# Altium schematic sheet [05] - I2C.SchDoc
size A3; DocumentNumber: 9; SheetNumber: 9; SheetTotal: 14
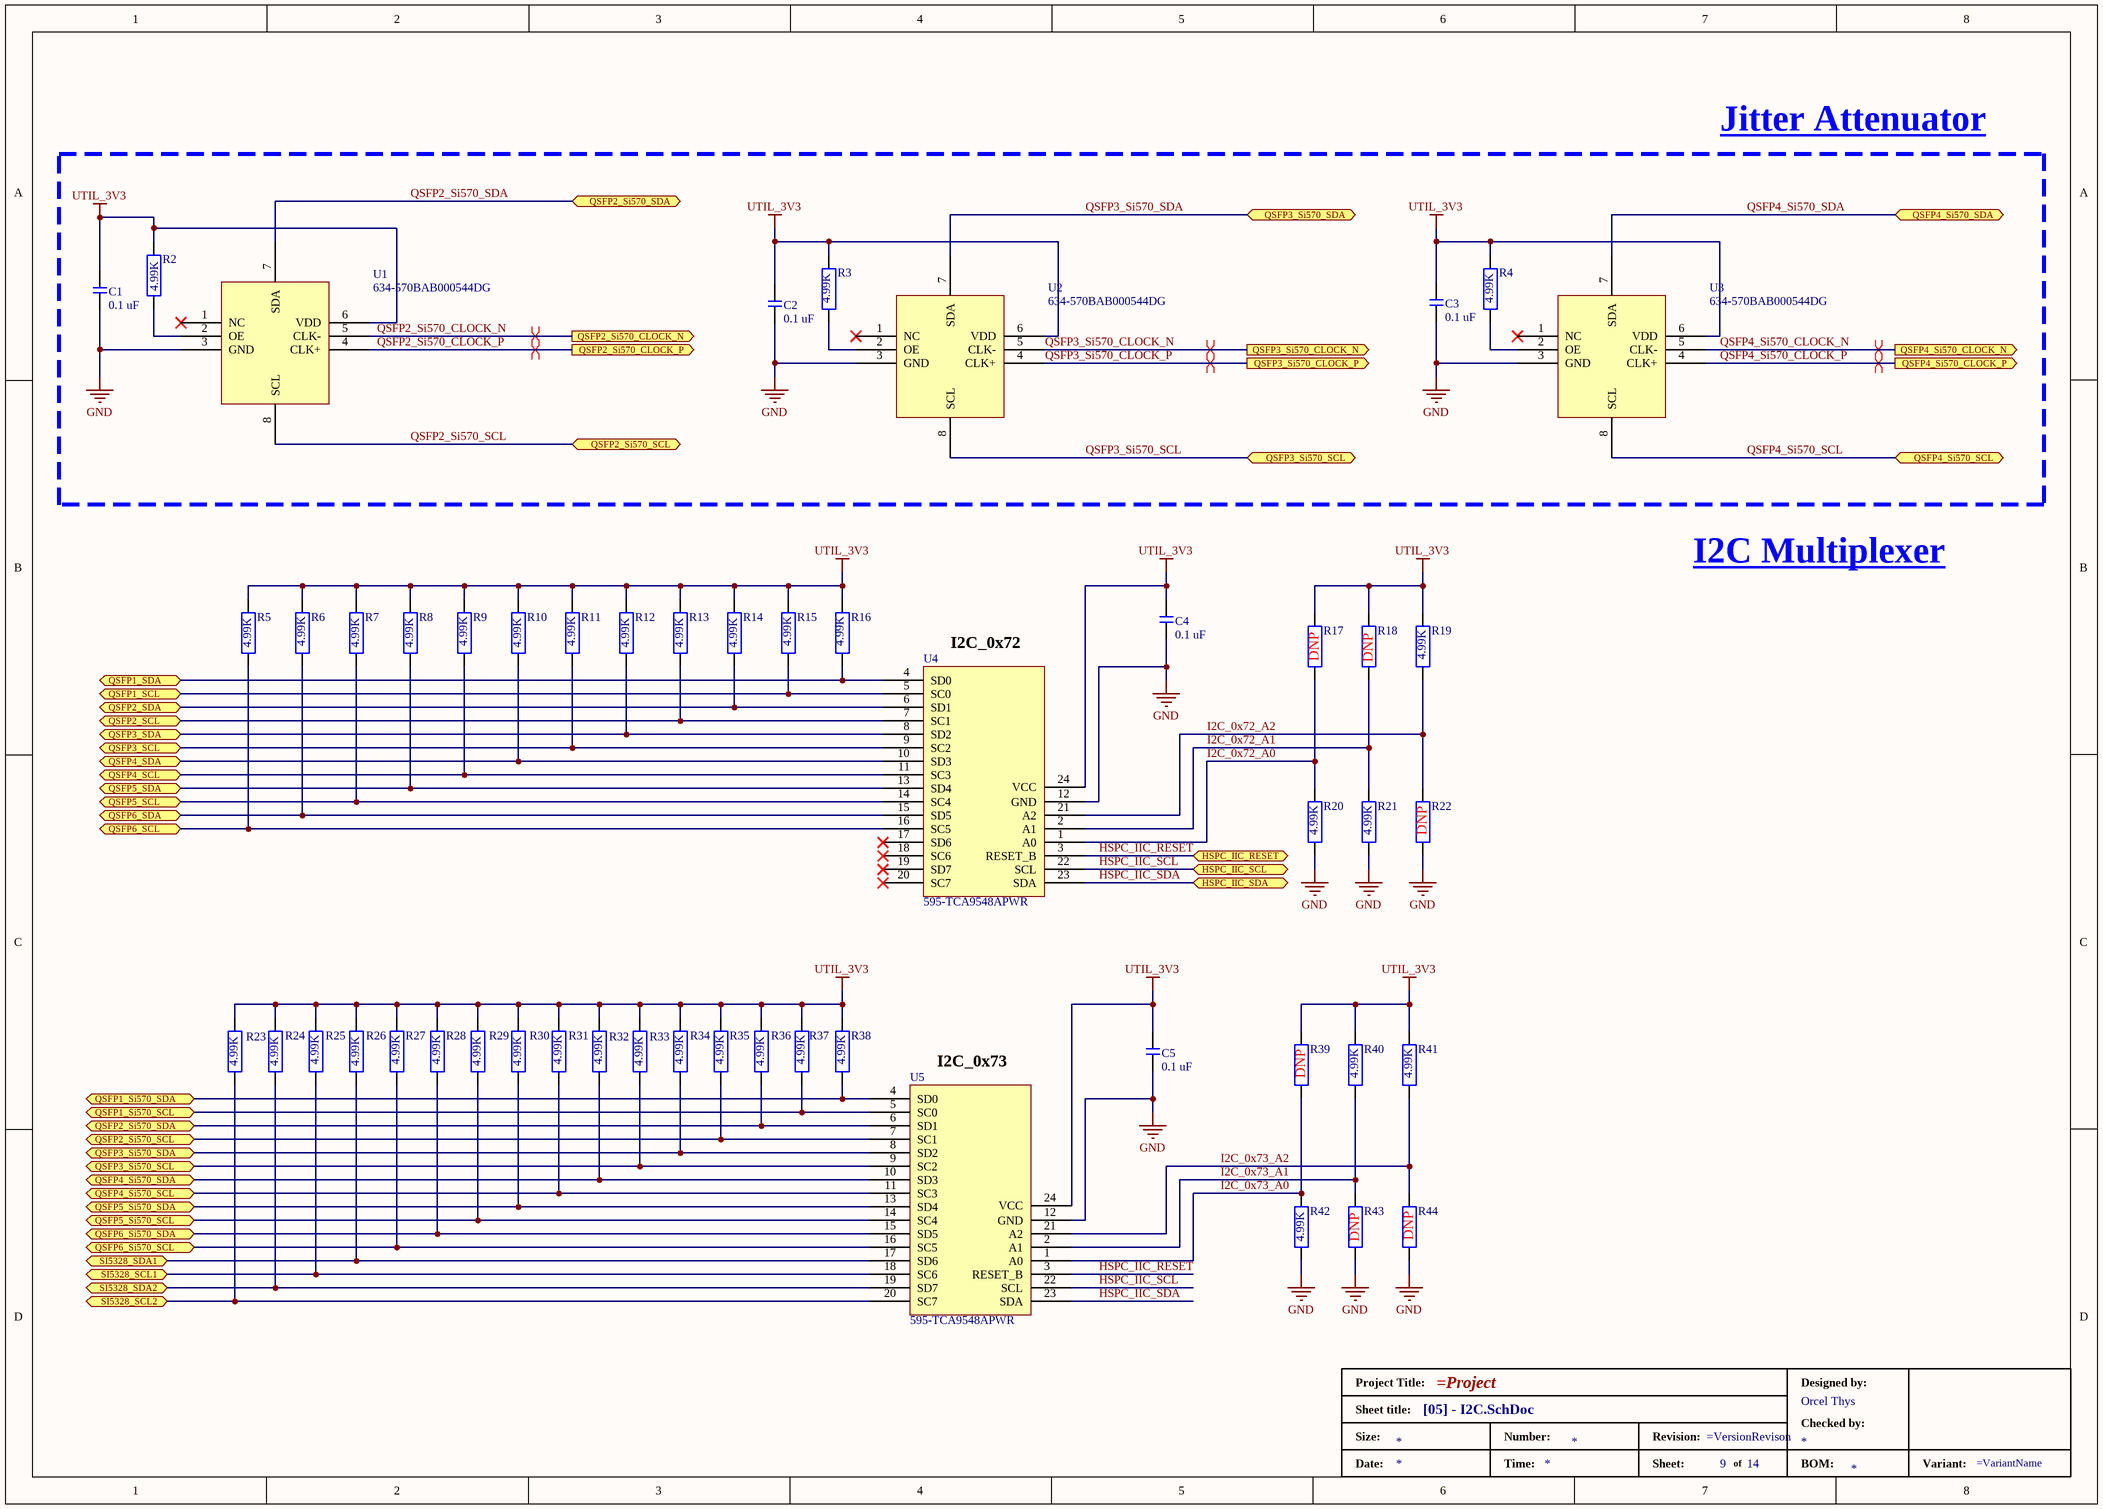
[diagram p0: [05] - I2C.SchDoc]

## Parts
*  DesignedBy: Orcel Thys  (hidden comment: Standard Title Block)  (graphical)
C1  0.1 uF  [C0402]
C2  0.1 uF  [C0402]
C3  0.1 uF  [C0402]
C4  0.1 uF  [C0402]
C5  0.1 uF  [C0402]
R2  4.99K  [R0402]
R3  4.99K  [R0402]
R4  4.99K  [R0402]
R5  4.99K  [R0402]
R6  4.99K  [R0402]
R7  4.99K  [R0402]
R8  4.99K  [R0402]
R9  4.99K  [R0402]
R10  4.99K  [R0402]
R11  4.99K  [R0402]
R12  4.99K  [R0402]
R13  4.99K  [R0402]
R14  4.99K  [R0402]
R15  4.99K  [R0402]
R16  4.99K  [R0402]
R17  4.99K  [R0402]  (value not drawn)
R18  4.99K  [R0402]  (value not drawn)
R19  4.99K  [R0402]
R20  4.99K  [R0402]
R21  4.99K  [R0402]
R22  4.99K  [R0402]  (value not drawn)
R23  4.99K  [R0402]
R24  4.99K  [R0402]
R25  4.99K  [R0402]
R26  4.99K  [R0402]
R27  4.99K  [R0402]
R28  4.99K  [R0402]
R29  4.99K  [R0402]
R30  4.99K  [R0402]
R31  4.99K  [R0402]
R32  4.99K  [R0402]
R33  4.99K  [R0402]
R34  4.99K  [R0402]
R35  4.99K  [R0402]
R36  4.99K  [R0402]
R37  4.99K  [R0402]
R38  4.99K  [R0402]
R39  4.99K  [R0402]  (value not drawn)
R40  4.99K  [R0402]
R41  4.99K  [R0402]
R42  4.99K  [R0402]
R43  4.99K  [R0402]  (value not drawn)
R44  4.99K  [R0402]  (value not drawn)
U1  Supplier Part Number 1: 634-570BAB000544DG  [Si570]  (hidden comment: Si570)
U2  Supplier Part Number 1: 634-570BAB000544DG  [Si570]  (hidden comment: Si570)
U3  Supplier Part Number 1: 634-570BAB000544DG  [Si570]  (hidden comment: Si570)
U4  Supplier Part Number 1: 595-TCA9548APWR  [SOP_65P640X120-24N]  (hidden comment: 8-Channels I2C switch)
U5  Supplier Part Number 1: 595-TCA9548APWR  [SOP_65P640X120-24N]  (hidden comment: 8-Channels I2C switch)

## Blocks framed on the sheet
Jitter Attenuator: C1-C3 R2-R4 U1-U3

## Ports
HSPC_IIC_RESET (bidir), HSPC_IIC_SCL (bidir), HSPC_IIC_SDA (bidir), QSFP1_SCL (bidir), QSFP1_SDA (bidir), QSFP1_Si570_SCL (bidir), QSFP1_Si570_SDA (bidir), QSFP2_SCL (bidir), QSFP2_SDA (bidir), QSFP2_Si570_CLOCK_N (out), QSFP2_Si570_CLOCK_P (out), QSFP2_Si570_SCL (bidir), QSFP2_Si570_SDA (bidir), QSFP3_SCL (bidir), QSFP3_SDA (bidir), QSFP3_Si570_CLOCK_N (out), QSFP3_Si570_CLOCK_P (out), QSFP3_Si570_SCL (bidir), QSFP3_Si570_SDA (bidir), QSFP4_SCL (bidir), QSFP4_SDA (bidir), QSFP4_Si570_CLOCK_N (out), QSFP4_Si570_CLOCK_P (out), QSFP4_Si570_SCL (bidir), QSFP4_Si570_SDA (bidir), QSFP5_SCL (bidir), QSFP5_SDA (bidir), QSFP5_Si570_SCL (bidir), QSFP5_Si570_SDA (bidir), QSFP6_SCL (bidir), QSFP6_SDA (bidir), QSFP6_Si570_SCL (bidir), QSFP6_Si570_SDA (bidir), SI5328_SCL1 (bidir), SI5328_SCL2 (bidir), SI5328_SDA1 (bidir), SI5328_SDA2 (bidir)

## Nets
GND: C1.2 C2.2 C3.2 C4.1 C5.1 R20.1 R21.1 R22.1 R42.1 R43.1 R44.1 U1.3(GND) U2.3(GND) U3.3(GND) U4.12(GND) U5.12(GND)
UTIL_3V3: C1.1 C2.1 C3.1 C4.2 C5.2 R2.2 R3.2 R4.2 R5.2 R6.2 R7.2 R8.2 R9.2 R10.2 R11.2 R12.2 R13.2 R14.2 R15.2 R16.2 R17.2 R18.2 R19.2 R23.2 R24.2 R25.2 R26.2 R27.2 R28.2 R29.2 R30.2 R31.2 R32.2 R33.2 R34.2 R35.2 R36.2 R37.2 R38.2 R39.2 R40.2 R41.2 U1.6(VDD) U2.6(VDD) U3.6(VDD) U4.24(VCC) U5.24(VCC)
HSPC_IIC_RESET: U4.3(RESET_B) U5.3(RESET_B) ; port HSPC_IIC_RESET
HSPC_IIC_SCL: U4.22(SCL) U5.22(SCL) ; port HSPC_IIC_SCL
HSPC_IIC_SDA: U4.23(SDA) U5.23(SDA) ; port HSPC_IIC_SDA
I2C_0x72_A0: R17.1 R20.2 U4.1(A0)
I2C_0x72_A1: R18.1 R21.2 U4.2(A1)
I2C_0x72_A2: R19.1 R22.2 U4.21(A2)
I2C_0x73_A0: R39.1 R42.2 U5.1(A0)
I2C_0x73_A1: R40.1 R43.2 U5.2(A1)
I2C_0x73_A2: R41.1 R44.2 U5.21(A2)
QSFP1_SCL: R15.1 U4.5(SC0) ; port QSFP1_SCL
QSFP1_SDA: R16.1 U4.4(SD0) ; port QSFP1_SDA
QSFP1_Si570_SCL: R37.1 U5.5(SC0) ; port QSFP1_Si570_SCL
QSFP1_Si570_SDA: R38.1 U5.4(SD0) ; port QSFP1_Si570_SDA
QSFP2_SCL: R13.1 U4.7(SC1) ; port QSFP2_SCL
QSFP2_SDA: R14.1 U4.6(SD1) ; port QSFP2_SDA
QSFP2_Si570_CLOCK_N: U1.5(CLK-) ; port QSFP2_Si570_CLOCK_N
QSFP2_Si570_CLOCK_P: U1.4(CLK+) ; port QSFP2_Si570_CLOCK_P
QSFP2_Si570_SCL: R35.1 U1.8(SCL) U5.7(SC1) ; port QSFP2_Si570_SCL
QSFP2_Si570_SDA: R36.1 U1.7(SDA) U5.6(SD1) ; port QSFP2_Si570_SDA
QSFP3_SCL: R11.1 U4.9(SC2) ; port QSFP3_SCL
QSFP3_SDA: R12.1 U4.8(SD2) ; port QSFP3_SDA
QSFP3_Si570_CLOCK_N: U2.5(CLK-) ; port QSFP3_Si570_CLOCK_N
QSFP3_Si570_CLOCK_P: U2.4(CLK+) ; port QSFP3_Si570_CLOCK_P
QSFP3_Si570_SCL: R33.1 U2.8(SCL) U5.9(SC2) ; port QSFP3_Si570_SCL
QSFP3_Si570_SDA: R34.1 U2.7(SDA) U5.8(SD2) ; port QSFP3_Si570_SDA
QSFP4_SCL: R9.1 U4.11(SC3) ; port QSFP4_SCL
QSFP4_SDA: R10.1 U4.10(SD3) ; port QSFP4_SDA
QSFP4_Si570_CLOCK_N: U3.5(CLK-) ; port QSFP4_Si570_CLOCK_N
QSFP4_Si570_CLOCK_P: U3.4(CLK+) ; port QSFP4_Si570_CLOCK_P
QSFP4_Si570_SCL: R31.1 U3.8(SCL) U5.11(SC3) ; port QSFP4_Si570_SCL
QSFP4_Si570_SDA: R32.1 U3.7(SDA) U5.10(SD3) ; port QSFP4_Si570_SDA
QSFP5_SCL: R7.1 U4.14(SC4) ; port QSFP5_SCL
QSFP5_SDA: R8.1 U4.13(SD4) ; port QSFP5_SDA
QSFP5_Si570_SCL: R29.1 U5.14(SC4) ; port QSFP5_Si570_SCL
QSFP5_Si570_SDA: R30.1 U5.13(SD4) ; port QSFP5_Si570_SDA
QSFP6_SCL: R5.1 U4.16(SC5) ; port QSFP6_SCL
QSFP6_SDA: R6.1 U4.15(SD5) ; port QSFP6_SDA
QSFP6_Si570_SCL: R27.1 U5.16(SC5) ; port QSFP6_Si570_SCL
QSFP6_Si570_SDA: R28.1 U5.15(SD5) ; port QSFP6_Si570_SDA
SI5328_SCL1: R25.1 U5.18(SC6) ; port SI5328_SCL1
SI5328_SCL2: R23.1 U5.20(SC7) ; port SI5328_SCL2
SI5328_SDA1: R26.1 U5.17(SD6) ; port SI5328_SDA1
SI5328_SDA2: R24.1 U5.19(SD7) ; port SI5328_SDA2
NetR2_1: R2.1 U1.2(OE)
NetR3_1: R3.1 U2.2(OE)
NetR4_1: R4.1 U3.2(OE)

Not connected (* = marked no-connect by the designer): U1 1(NC)*; U2 1(NC)*; U3 1(NC)*; U4 17(SD6)* 18(SC6)* 19(SD7)* 20(SC7)*

## Layout directives
differential pair: QSFP2_Si570_CLOCK_N, QSFP2_Si570_CLOCK_P, QSFP3_Si570_CLOCK_N, QSFP3_Si570_CLOCK_P, QSFP4_Si570_CLOCK_N, QSFP4_Si570_CLOCK_P

## Notes on the sheet
- I2C Multiplexer
- (near U4) I2C_0x72
- (near R17) DNP
- (near R18) DNP
- (near R22) DNP
- (near U5) I2C_0x73
- (near R39) DNP
- (near R43) DNP
- (near R44) DNP
- Title
- Size:
- Date:
- A4
- Number:
- Time:
- Revision:
- Sheet
- of
- File:
- (in symbol Title_Block) Project Title:; Designed by:; Sheet title:; Checked by:; Size:; Number:; Revision:; Date:; Time:; Sheet:; of; BOM:; Variant:

## Library data of the parts
* = Title_Block: Size: *; BOM: *; DW: *; CheckedBy: *
C1-C5 = UMK105B7104KV-FR: Cap 0402 0.1 uF 50 V ±10 % Tolerance X7R Surface Mount Multilayer Ceramic Capacitor; Manufacturer: Taiyo Yuden; Voltage Rating: 50V; Capacitance: 100nF; Tolerance: 10%; Supplier 1: Rs; Manufacturer Part Number: UMK105B7104KV-FR; RoHS: Yes; Category: Ceramic Capacitors; Stock 1: 60000; Pricing 1: 10000=0.016 (EUR); Mount: Surface Mount; Case/Package: 0402; Case Code (Imperial): 0402; Case Code (Metric): 1005; Min Operating Temperature: -55°C; Max Operating Temperature: 125°C; Voltage Rating (DC): 50V; Packaging: Tape and Reel; Package Quantity: 1; Dielectric: X7R; Termination: SMD/SMT; Series: M; Length: 0.039inch; Width: 0.02inch; Height: 0.5mm; Thickness: 0.022inch; Lead Free: Lead Free; Halogen Free: Halogen Free; RoHS Compliant: Yes; ComponentLink1URL: https://datasheet.ciiva.com/24356/619umk105b7104kv-fr-24356845.pdf?src-supplier=Onlinecomponents.com; ComponentLink1Description: https://datasheet.ciiva.com/24356/619umk105b7104kv-fr-24356845.pdf?src-supplier=Onlinecomponents.com; ComponentLink2URL: https://datasheet.ciiva.com/30180/52umk105b7104kv-fr-30180098.pdf?src-supplier=Onlinecomponents.com; ComponentLink2Description: https://datasheet.ciiva.com/30180/52umk105b7104kv-fr-30180098.pdf?src-supplier=Onlinecomponents.com; ComponentLink3URL: https://datasheet.ciiva.com/18697/mlcc-all-e-18697452.pdf?src-supplier=Digi-Key; ComponentLink3Description: https://datasheet.ciiva.com/18697/mlcc-all-e-18697452.pdf?src-supplier=Digi-Key; ComponentLink4URL: https://datasheet.ciiva.com/18697/mlcc-all-e-18697451.pdf?src-supplier=Digi-Key; ComponentLink4Description: https://datasheet.ciiva.com/18697/mlcc-all-e-18697451.pdf?src-supplier=Digi-Key; ComponentLink5URL: https://datasheet.ciiva.com/18697/mlcc-all-e-18697453.pdf?src-supplier=Digi-Key; ComponentLink5Description: https://datasheet.ciiva.com/18697/mlcc-all-e-18697453.pdf?src-supplier=Digi-Key; Supplier Part Number 1: 1782869
R2-R44 = ERJ-2RKF4991X: RES SMD 4.99K OHM 1% 1/10W 0402; Manufacturer: Panasonic; Resistance: 4.99kR; Power Rating: 100mW; Voltage Rating: 50V; Temperature Coefficient: 100ppm/°C; Supplier 1: Mouser; Manufacturer Part Number: ERJ-2RKF4991X; RoHS: Yes; Category: Chip SMD Resistors; Stock 1: 1218727; Pricing 1: 1=0.1, 10=0.018, 50=0.018, 100=0.008, 1000=0.006, 10000=0.004 (USD); Mount: Surface Mount; Case/Package: 0402; Case Code (Metric): 1005; Case Code (Imperial): 0402; Contact Plating: Tin; Weight: 2.8E-05oz; Min Operating Temperature: -55°C; Max Operating Temperature: 155°C; Tolerance: 1%; Packaging: Tape and Reel; Package Quantity: 1; Resistor Type: Thick Film; Number of Terminations: 2; Termination: SMD/SMT; Max Power Dissipation: 100mW; Voltage Rating (DC): 50V; Features: Automotive AEC-Q200; Series: ERJ; Resistance Tolerance: 1%; Construction: Rectangular; Working Voltage: 50V; Technology: THICK FILM; Length: 1mm; Width: 0.5mm; Height: 0.016inch; Depth: 0.5mm; Radiation Hardening: No; Reach SVHC Compliant: No; Military Standard: Not; Lead Free: Lead Free; RoHS Compliant: Yes; ComponentLink1URL: https://datasheet.ciiva.com/46388/426256-46388311.pdf?src-supplier=Element14; ComponentLink1Description: https://datasheet.ciiva.com/46388/426256-46388311.pdf?src-supplier=Element14; ComponentLink2URL: https://datasheet.ciiva.com/46376/426256-46376955.pdf?src-supplier=Element14; ComponentLink2Description: https://datasheet.ciiva.com/46376/426256-46376955.pdf?src-supplier=Element14; ComponentLink3URL: https://datasheet.ciiva.com/22749/1678782-22749654.pdf?src-supplier=Element14; ComponentLink3Description: https://datasheet.ciiva.com/22749/1678782-22749654.pdf?src-supplier=Element14; ComponentLink4URL: https://datasheet.ciiva.com/24158/aoa0000ce2-24158871.pdf?src-supplier=Mouser; ComponentLink4Description: https://datasheet.ciiva.com/24158/aoa0000ce2-24158871.pdf?src-supplier=Mouser; ComponentLink5URL: https://datasheet.ciiva.com/16775/70260748-16775018.pdf?src-supplier=Allied+Electronics; ComponentLink5Description: https://datasheet.ciiva.com/16775/70260748-16775018.pdf?src-supplier=Allied+Electronics; ComponentLink6URL: https://datasheet.ciiva.com/16773/70260748-16773110.pdf?src-supplier=Allied+Electronics; ComponentLink6Description: https://datasheet.ciiva.com/16773/70260748-16773110.pdf?src-supplier=Allied+Electronics; ComponentLink7URL: https://datasheet.ciiva.com/16199/aoa0000ce2-16199546.pdf?src-supplier=Future+Electronics; ComponentLink7Description: https://datasheet.ciiva.com/16199/aoa0000ce2-16199546.pdf?src-supplier=Future+Electronics; Supplier Part Number 1: 667-ERJ-2RKF4991X
U1-U3 = 570BAB000544DG: 10 MHZ TO 810 MHZ I2C PROG 0x5D, 156.25MHz DEFAULT; Manufacturer: Skyworks Solutions; Supplier 1: Mouser; Manufacturer Part Number: 570BAB000544DG; RoHS: No; Category: Oscillators; Stock 1: 1408; Pricing 1: 1=42.62, 10=40.41, 50=39.67, 100=38.2, 1000=38.2, 10000=38.2 (USD)
U4 U5 = TCA9548APWR: IC I2C SW 8CH W/RESET 24TSSOP; Manufacturer: Texas Instruments; Max Supply Voltage: 5.5V; Min Supply Voltage: 1.65V; Max Supply Current: 80uA; Supply Type: Single; Independent Circuits: 1; Supplier 1: Mouser; Manufacturer Part Number: TCA9548APWR; RoHS: Yes; Category: Decoders and Multiplexers; Stock 1: 38959; Pricing 1: 1=1.81, 10=1.63, 50=1.54, 100=1.29, 1000=0.87, 10000=0.8 (USD); Mount: Surface Mount; Case/Package: TSSOP; Number of Pins: 24; Min Operating Temperature: -40°C; Max Operating Temperature: 85°C; Packaging: Tape and Reel; Package Quantity: 2000; Series: TCA; Reach SVHC Compliant: No; Lead Free: Lead Free; RoHS Compliant: Yes; ComponentLink1URL: https://datasheet.ciiva.com/6614/tca9548a-6614721.pdf?src-supplier=Digi-Key; ComponentLink1Description: https://datasheet.ciiva.com/6614/tca9548a-6614721.pdf?src-supplier=Digi-Key